# Altium schematic sheet DS3231.SchDoc
size A3; SheetNumber: 3; SheetTotal: 5
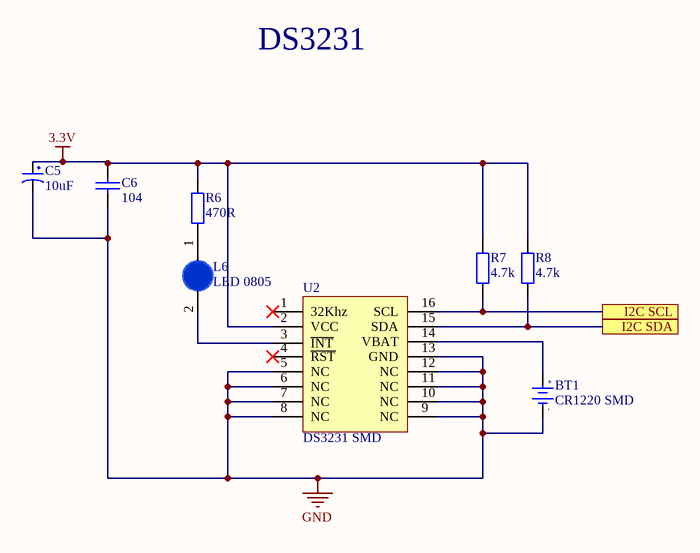
[diagram p0: DS3231.SchDoc]

## Parts
BT1  CR1220 SMD  [DE PIN CR1220]
C5  10uF  [tu tantalum smd3216]
C6  104  [tu 0805]
L6  LED 0805  [LED-0805-Blue]
R6  470R  [Tro SMD 0805]
R7  4.7k  [tro smd 0805]
R8  4.7k  [tro smd 0805]
U2  DS3231 SMD  [SOIC 16]

## Ports
I2C SCL, I2C SDA

## Nets
3.3V: C5.1 C6.1 R6.2 R7.2 R8.2 U2.2(VCC)
GND: BT1.2(GND) C5.2 C6.2 U2.5(NC) U2.6(NC) U2.7(NC) U2.8(NC) U2.9(NC) U2.10(NC) U2.11(NC) U2.12(NC) U2.13(GND)
I2C SCL: R7.1 U2.16(SCL) ; port I2C SCL
I2C SDA: R8.1 U2.15(SDA) ; port I2C SDA
NetBT1_1: BT1.1(+3V) U2.14(VBAT)
NetL6_1: L6.1(A) R6.1
NetL6_2: L6.2(K) U2.3(~{INT})

Not connected (* = marked no-connect by the designer): U2 1(32Khz)* 4(~{RST})*

## Notes on the sheet
- DS3231
- (in symbol De pin CR1220 SMD) +; -

## Library data of the parts
BT1 = De pin CR1220 SMD: Ten: Đế PIN CR1220 SMD; Ma_Hang: MH000833
C5 = Tu tantalum 10uF 16V SMD3216: Dán; Don_Vi: Con; So_Chan: 2; Ten_Linh_Kien: Tụ tantalum 106C-10uF 16V SMD3216; Ma_Hang: MH001954; Chung_Loai: Dán; Kieu_Chan: *
C6 = Tu 0805 104 50V 10%: Dán; Don_Vi: Con; So_Chan: 2; Ten_Linh_Kien: Tụ 0805 104-100nF 10% 50V; Ma_Hang: MH004551; Chung_Loai: Dán; Kieu_Chan: *
L6 = LED 0805 Xanh Duong: Dán; Don_Vi: Con; Ma_Hang: MH002327; Ten_Linh_Kien: LED 0805 Màu Xanh Dương (Blue); Ghi_Chu: *; Kieu_Chan: *; Chung_Loai: Dán
R6 = Tro 0805 5% 470R: Dán; Don_Vi: Con; Ma_Hang: MH005341; Ten_Linh_Kien: Trở 0805 5% 470R; So_Chan: 2; Chung_Loai: Dán; Kieu_Chan: *
R7 R8 = Tro 0805 5% 4.7k: Dán; Don_Vi: Con; So_Chan: 2; Ten_Linh_Kien: Trở 0805 5% 4.7k; Ma_Hang: MH005307; Chung_Loai: Dán; Kieu_Chan: *
U2 = DS3231 SMD: SOIC